# Altium schematic sheet UD3.1 Supplies.SchDoc
size A4; DocumentNumber: 2; SheetNumber: 2; SheetTotal: 7
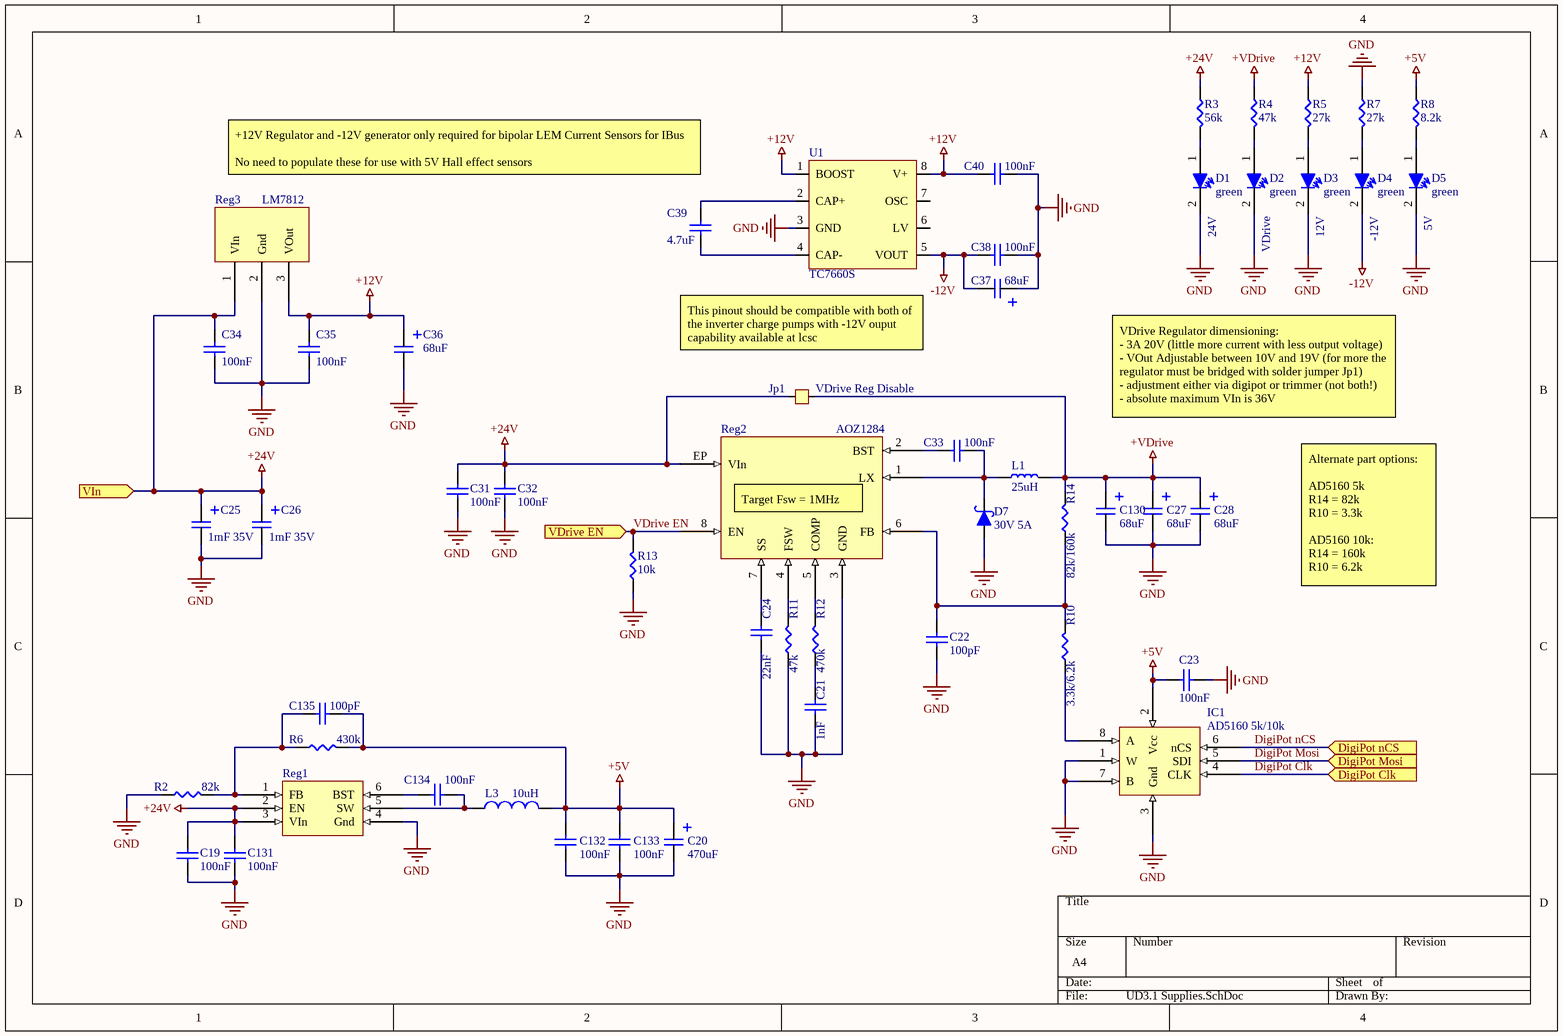
[diagram p0: UD3.1 Supplies.SchDoc]

## Parts
C19  100nF  [0603]
C20  470uF  [Elko 6,3 x 11 x 2,5]
C21  1nF  [0603]
C22  100pF  [0603]
C23  100nF  [0603]
C24  22nF  [0603]
C25  1mF 35V  [Elko 13 x 25 x 5]
C26  1mF 35V  [Elko 13 x 25 x 5]
C27  68uF  [Elko 6,3 x 11 x 2,5]
C28  68uF  [Elko 6,3 x 11 x 2,5]
C31  100nF  [0603]
C32  100nF  [0603]
C33  100nF  [0603]
C34  100nF  [0603]
C35  100nF  [0603]
C36  68uF  [Elko 6,3 x 11 x 2,5]
C37  68uF  [Elko 6,3 x 11 x 2,5]
C38  100nF  [0603]
C39  4.7uF  [0603]
C40  100nF  [0603]
C130  68uF  [Elko 6,3 x 11 x 2,5]
C131  100nF  [0603]
C132  100nF  [0603]
C133  100nF  [0603]
C134  100nF  [0603]
C135  100pF  [0603]
D1  green  [1206 Reverse Mount]
D2  green  [1206 Reverse Mount]
D3  green  [1206 Reverse Mount]
D4  green  [1206 Reverse Mount]
D5  green  [1206 Reverse Mount]
D7  30V 5A  [DO-214]
IC1  AD5160 5k/10k  [Sot 23-8]
Jp1  VDrive Reg Disable  [PCB Jumper NO]
L1  25uH  [Inductor 11x11mm]
L3  10uH  [1008]
R2  82k  [0603]
R3  56k  [0603]
R4  47k  [0603]
R5  27k  [0603]
R6  430k  [0603]
R7  27k  [0603]
R8  8.2k  [0603]
R10  3.3k/6.2k  [0603]
R11  47k  [0603]
R12  470k  [0603]
R13  10k  [0603]
R14  82k/160k  [0603]
Reg1  Buck regulator  [TSOT26]  (value not drawn)
Reg2  AOZ1284  [SOIC8 EXPOSED]
Reg3  LM7812  [TO252 DPAk]
U1  TC7660S  [SOIC8]

## Ports
DigiPot Clk (in), DigiPot Mosi (in), DigiPot nCS (in), VDrive EN (in), VIn (in)

## Nets
+5V: C20.1 C23.2 C132.1 C133.1 C135.1 IC1.2(Vcc) L3.2 R6.2 R8.1
+12V: C35.2 C36.1 C40.2 R5.1 Reg3.3(VOut) U1.1(BOOST) U1.8(V+)
+24V: C19.2 C25.1 C26.1 C31.2 C32.2 C34.2 C131.1 Jp1.1 R3.1 Reg1.2(EN) Reg1.3(VIn) Reg2.EP(VIn) Reg3.1(VIn) ; port VIn
+VDrive: C27.1 C28.1 C130.1 Jp1.2 L1.2 R4.1 R14.2
-12V: C37.2 C38.2 D4.2 U1.5(VOUT)
GND: C19.1 C20.2 C21.1 C22.2 C23.1 C24.1 C25.2 C26.2 C27.2 C28.2 C31.1 C32.1 C34.1 C35.1 C36.2 C37.1 C38.1 C40.1 C130.2 C131.2 C132.2 C133.2 D1.2 D2.2 D3.2 D5.2 D7.1 IC1.1(W) IC1.3(Gnd) IC1.7(B) R2.1 R7.1 R11.1 R13.1 Reg1.4(Gnd) Reg2.3(GND) Reg3.2(Gnd) U1.3(GND)
DigiPot Clk: IC1.4(CLK) ; port DigiPot Clk
DigiPot Mosi: IC1.5(SDI) ; port DigiPot Mosi
DigiPot nCS: IC1.6(nCS) ; port DigiPot nCS
VDrive EN: R13.2 Reg2.8(EN) ; port VDrive EN
NetC21_2: C21.2 R12.1
NetC22_1: C22.1 R10.2 R14.1 Reg2.6(FB)
NetC24_2: C24.2 Reg2.7(SS)
NetC33_1: C33.1 D7.2 L1.1 Reg2.1(LX)
NetC33_2: C33.2 Reg2.2(BST)
NetC39_1: C39.1 U1.2(CAP+)
NetC39_2: C39.2 U1.4(CAP-)
NetC134_1: C134.1 Reg1.6(BST)
NetC134_2: C134.2 L3.1 Reg1.5(SW)
NetC135_2: C135.2 R2.2 R6.1 Reg1.1(FB)
NetD1_1: D1.1 R3.2
NetD2_1: D2.1 R4.2
NetD3_1: D3.1 R5.2
NetD4_1: D4.1 R7.2
NetD5_1: D5.1 R8.2
NetIC1_8: IC1.8(A) R10.1
NetR11_2: R11.2 Reg2.4(FSW)
NetR12_2: R12.2 Reg2.5(COMP)

Not connected (* = marked no-connect by the designer): U1 6(LV) 7(OSC)

## Notes on the sheet
- (near C39) +12V Regulator and -12V generator only required for bipolar LEM Current Sensors for IBus
  No need to populate these for use with 5V Hall effect sensors
- 24V
- VDrive
- 12V
- -12V
- (near D5) 5V
- This pinout should be compatible with both of the inverter charge pumps with -12V ouput capability available at lcsc
- VDrive Regulator dimensioning:
  - 3A 20V (little more current with less output voltage)
  - VOut Adjustable between 10V and 19V (for more the regulator must be bridged with solder jumper Jp1)
  - adjustment either via digipot or trimmer (not both!)
  - absolute maximum VIn is 36V
- (near Reg2) Target Fsw = 1MHz
- Alternate part options:
  AD5160 5k
  R14 = 82k
  R10 = 3.3k
  AD5160 10k:
  R14 = 160k
  R10 = 6.2k

## Library data of the parts
C19 C21-C24 C31-C35 C38-C40 C131-C135 = Cap
  C19 C131-C135: Supplier 1: Digi-Key; Supplier 2: Digi-Key; Supplier 3: Digi-Key; Supplier Part Number 1: 1276-2044-1-ND; Supplier Part Number 2: 1276-1018-1-ND; Supplier Part Number 3: 1276-1182-1-ND; Supplier 4: Digi-Key; Supplier 5: Digi-Key; Supplier 6: Digi-Key; Supplier 7: Digi-Key; Supplier 8: Digi-Key; Supplier 9: Digi-Key; Supplier Part Number 4: 1276-1009-1-ND; Supplier Part Number 5: 1276-1098-1-ND; Supplier Part Number 6: 1276-1119-1-ND; Supplier Part Number 7: 490-12737-1-ND; Supplier Part Number 9: 587-1249-1-ND; Supplier Part Number 8: 1276-1183-1-ND; Supplier 10: Digi-Key; Supplier 11: Digi-Key; Supplier 12: Digi-Key; Supplier 13: Digi-Key; Supplier Part Number 10: 1276-CL10B104KB8NNNLCT-ND; Supplier Part Number 11: 399-1085-1-ND; Supplier Part Number 13: 587-2985-1-ND; Supplier Part Number 12: 1276-1021-1-ND; Supplier 14: Digi-Key; Supplier 15: Digi-Key; Supplier 16: Digi-Key; Supplier 17: Digi-Key; Supplier 18: Digi-Key; Supplier 19: Digi-Key; Supplier Part Number 14: 490-14603-1-ND; Supplier Part Number 15: 311-3700-1-ND; Supplier Part Number 16: 311-1042-1-ND; Supplier Part Number 17: 311-1415-1-ND; Supplier Part Number 19: 587-4321-1-ND; Supplier Part Number 18: 1276-1907-1-ND; Supplier 20: Digi-Key; Supplier 21: Digi-Key; Supplier 22: Digi-Key; Supplier Part Number 20: 1276-6767-1-ND; Supplier Part Number 21: 1276-7060-1-ND; Supplier Part Number 22: 311-1084-1-ND
C20 C25-C28 C36 C37 C130 = Cap Polar: Supplier 1: Digi-Key; Supplier Part Number 1: 478-9181-1-ND; Supplier 2: Digi-Key; Supplier 3: Digi-Key; Supplier Part Number 2: 478-9173-1-ND; Supplier Part Number 3: 493-11037-ND; Supplier 4: Digi-Key; Supplier 5: Digi-Key; Supplier Part Number 4: PCE3462CT-ND; Supplier Part Number 5: 399-18864-1-ND; Supplier 6: Digi-Key; Supplier Part Number 6: 399-10512-1-ND; Supplier 7: Digi-Key; Supplier Part Number 7: 399-15746-ND; Supplier 8: Digi-Key; Supplier Part Number 8: 1189-3752-1-ND
D1-D5 = LED: Diode, but it lights up; Supplier 1: Digi-Key; Supplier 2: Digi-Key; Supplier 3: Digi-Key; Supplier 4: Digi-Key; Supplier Part Number 1: 732-4979-1-ND; Supplier Part Number 2: 732-4971-1-ND; Supplier Part Number 3: 732-4966-1-ND; Supplier Part Number 4: 732-4981-1-ND
D7 = Diode Schottky: pin to pad: 1>2 2>1; Supplier 1: Digi-Key; Supplier Part Number 1: FSV12100VCT-ND
IC1 = AD5160: DigiPot 8bit
Jp1 = Jumper
L1 = Inductor High Power: Supplier 1: Digi-Key; Supplier Part Number 1: 541-1253-1-ND; Supplier 2: Digi-Key; Supplier Part Number 2: SRP1265A-1R0MCT-ND; Supplier 3: Digi-Key; Supplier Part Number 3: 732-4237-1-ND
L3 = Inductor: Supplier 1: Digi-Key; Supplier 2: Digi-Key; Supplier Part Number 1: 541-1250-1-ND; Supplier Part Number 2: 541-1253-1-ND; Supplier 3: Digi-Key; Supplier 4: Digi-Key; Supplier Part Number 3: SRN6028-3R9MCT-ND; Supplier Part Number 4: SRN6028-4R7MCT-ND; Supplier 5: Digi-Key; Supplier 6: Digi-Key; Supplier 7: Digi-Key; Supplier 8: Digi-Key; Supplier 9: Digi-Key; Supplier 10: Digi-Key; Supplier 11: Digi-Key; Supplier Part Number 5: 490-10563-1-ND; Supplier Part Number 6: 1276-6932-1-ND; Supplier Part Number 7: 587-2042-1-ND; Supplier Part Number 8: 535-12790-1-ND; Supplier Part Number 9: SRP1265A-1R0MCT-ND; Supplier Part Number 10: SRP1770TA-5R6MCT-ND; Supplier Part Number 11: SRN6028-100MCT-ND
R2-R8 R10-R14 = Resistor
Reg1 = AP6320: Supplier 1: Digi-Key; Supplier Part Number 1: AP63203WU-7DICT-ND; Supplier 2: Digi-Key; Supplier Part Number 2: AP63200WU-7DICT-ND; Supplier 3: Digi-Key; Supplier Part Number 3: AP63201WU-7DICT-ND
Reg2 = AOZ1284: Buck Regulator, Internal Switch 4A
Reg3 = lm78xx: positive voltage regulator